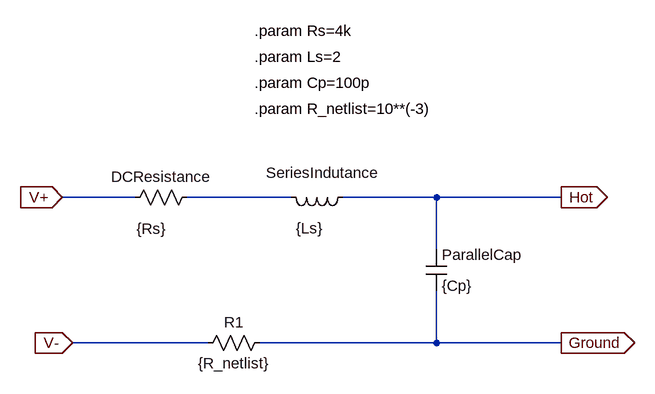
[diagram p0: schematic Base_SingleCoil.asc]
Base_SingleCoil.asc, the LTspice schematic file:
Version 4
SHEET 1 880 680
WIRE -176 144 -288 144
WIRE 64 144 -96 144
WIRE 288 144 144 144
WIRE 480 144 288 144
WIRE 288 224 288 144
WIRE -64 368 -272 368
WIRE 288 368 288 288
WIRE 288 368 16 368
WIRE 480 368 288 368
FLAG 480 144 Hot
IOPIN 480 144 Out
FLAG 480 368 Ground
IOPIN 480 368 Out
FLAG -288 144 V+
IOPIN -288 144 In
FLAG -272 368 V-
IOPIN -272 368 In
SYMBOL res -80 128 R90
WINDOW 0 0 56 VBottom 2
WINDOW 3 49 71 VTop 2
SYMATTR InstName DCResistance
SYMATTR Value {Rs}
SYMBOL ind 160 128 R90
WINDOW 0 -6 47 VBottom 2
WINDOW 3 48 67 VTop 2
SYMATTR InstName SeriesIndutance
SYMATTR Value {Ls}
SYMBOL cap 272 224 R0
SYMATTR InstName ParallelCap
SYMATTR Value {Cp}
SYMBOL res 32 352 R90
WINDOW 0 0 56 VBottom 2
WINDOW 3 32 56 VTop 2
SYMATTR InstName R1
SYMATTR Value {R_netlist}
TEXT 8 -112 Left 2 !.param Rs=4k
TEXT 8 -72 Left 2 !.param Ls=2
TEXT 8 -32 Left 2 !.param Cp=100p
TEXT 8 8 Left 2 !.param R_netlist=10**(-3)

The netlist it stands for:
* Base_SingleCoil.asc
R§DCResistance N001 V+ {Rs}
L§SeriesIndutance Hot N001 {Ls}
C§ParallelCap Hot Ground {Cp}
R1 Ground V- {R_netlist}
.param Rs=4k
.param Ls=2
.param Cp=100p
.param R_netlist=10**(-3)
.backanno
.end